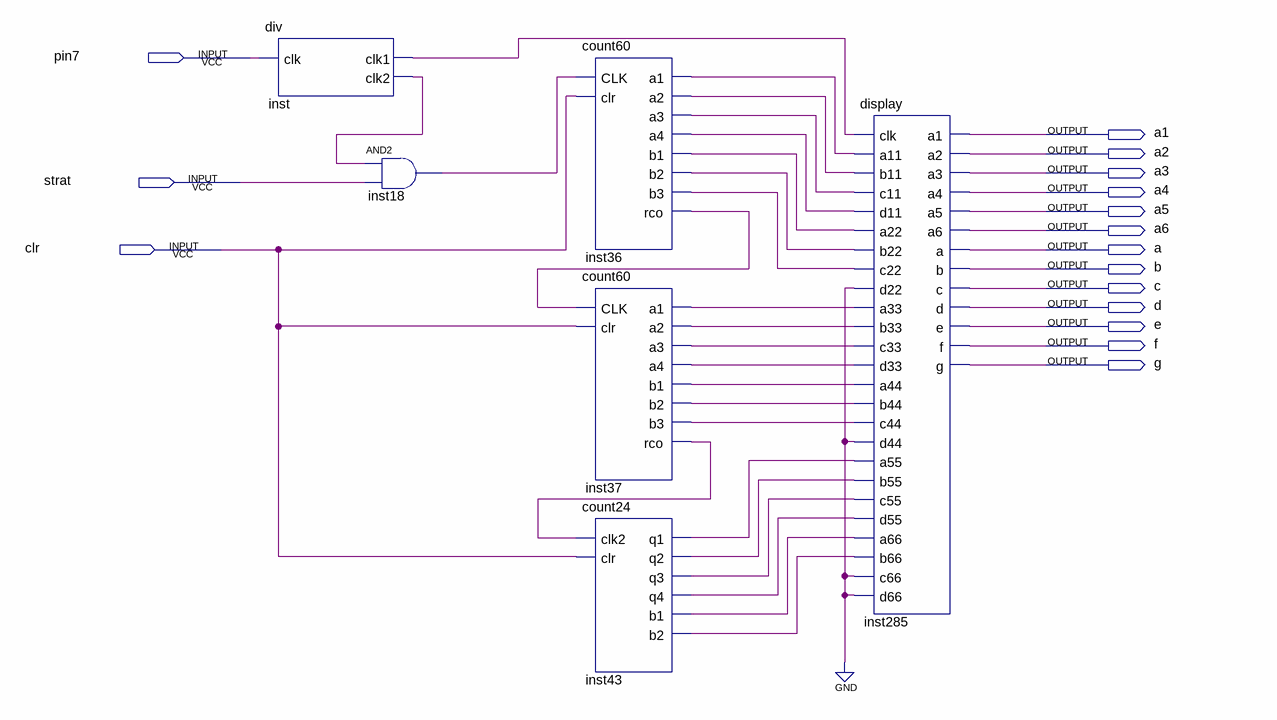
[diagram p0: schematic sheet]
// Quartus schematic lab11.bdf as structural Verilog: 6 symbols, 16 pins
module lab11 (
  input  pin7,
  input  strat,
  input  clr,
  output a1,
  output a2,
  output a3,
  output a4,
  output a5,
  output a6,
  output a,
  output b,
  output c,
  output d,
  output e,
  output f,
  output g
);

  wire inst18_out, inst36_a1, inst36_a2, inst36_a3, inst36_a4, inst36_b1, inst36_b2, inst36_b3, inst36_rco,
       inst37_a1, inst37_a2, inst37_a3, inst37_a4, inst37_b1, inst37_b2, inst37_b3, inst37_rco, inst43_b1,
       inst43_b2, inst43_q1, inst43_q2, inst43_q3, inst43_q4, inst_clk1, inst_clk2;

  div inst (.clk(pin7), .clk1(inst_clk1), .clk2(inst_clk2));
  and inst18 (inst18_out, inst_clk2, strat);
  count60 inst36 (
    .CLK(inst18_out), .clr(clr), .a1(inst36_a1), .a2(inst36_a2), .a3(inst36_a3), .a4(inst36_a4),
    .b1(inst36_b1), .b2(inst36_b2), .b3(inst36_b3), .rco(inst36_rco));
  count60 inst37 (
    .CLK(inst36_rco), .clr(clr), .a1(inst37_a1), .a2(inst37_a2), .a3(inst37_a3), .a4(inst37_a4),
    .b1(inst37_b1), .b2(inst37_b2), .b3(inst37_b3), .rco(inst37_rco));
  count24 inst43 (
    .clk2(inst37_rco), .clr(clr), .q1(inst43_q1), .q2(inst43_q2), .q3(inst43_q3), .q4(inst43_q4),
    .b1(inst43_b1), .b2(inst43_b2));
  display inst285 (
    .clk(inst_clk1), .a11(inst36_a1), .b11(inst36_a2), .c11(inst36_a3), .d11(inst36_a4), .a22(inst36_b1),
    .b22(inst36_b2), .c22(inst36_b3), .d22(1'b0), .a33(inst37_a1), .b33(inst37_a2), .c33(inst37_a3),
    .d33(inst37_a4), .a44(inst37_b1), .b44(inst37_b2), .c44(inst37_b3), .d44(1'b0), .a55(inst43_q1),
    .b55(inst43_q2), .c55(inst43_q3), .d55(inst43_q4), .a66(inst43_b1), .b66(inst43_b2), .c66(1'b0),
    .d66(1'b0), .a1(a1), .a2(a2), .a3(a3), .a4(a4), .a5(a5), .a6(a6), .a(a), .b(b), .c(c), .d(d), .e(e),
    .f(f), .g(g));
endmodule
